# Altium schematic sheet Input Filter.SchDoc
size A4
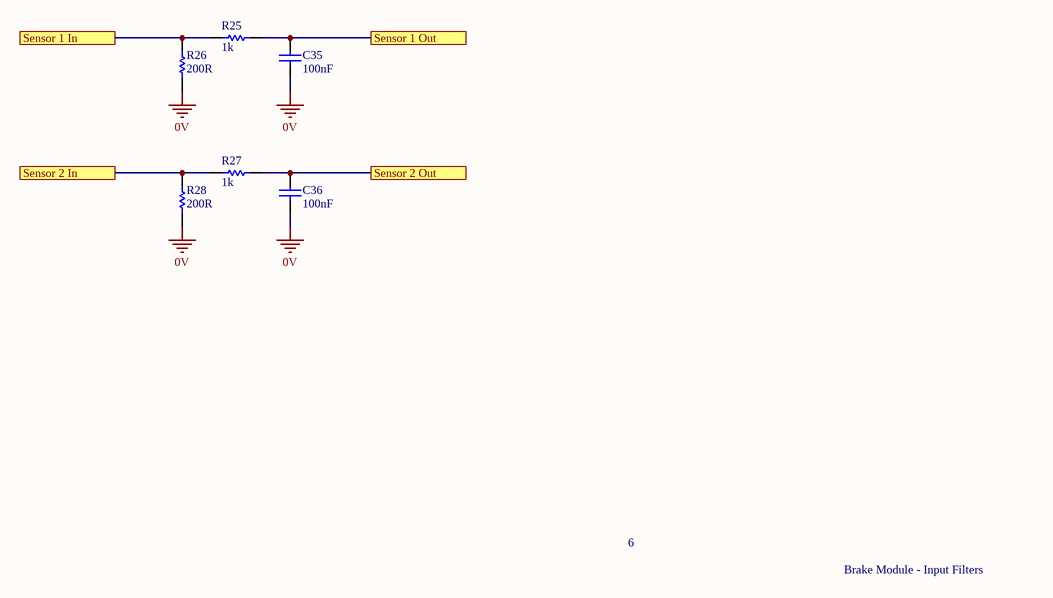
[diagram p0: Input Filter.SchDoc]

## Parts
C35  100nF  [0805]
C36  100nF  [0805]
R25  1k  [0805]
R26  200R  [0805]
R27  1k  [0805]
R28  200R  [0805]

## Ports
Sensor 1 In, Sensor 1 Out, Sensor 2 In, Sensor 2 Out

## Nets
0V: C35.1 C36.1 R26.1 R28.1
Sensor 1 In: R25.1 R26.2 ; port Sensor 1 In
Sensor 1 Out: C35.2 R25.2 ; port Sensor 1 Out
Sensor 2 In: R27.1 R28.2 ; port Sensor 2 In
Sensor 2 Out: C36.2 R27.2 ; port Sensor 2 Out

## Notes on the sheet
- 6
- Brake Module - Input Filters

## Library data of the parts
C35 C36 = GCM21BR71H104KA37L: Manufacturer: muRata; Tolerance: ±10%; Material: X7R; Rated Voltage: 50V; Part Number: GCM21BR71H104KA37L; Value: 100nF; Digikey Part Number: 490-6064-1-ND
R25 R27 = RC0805FR071KL: Manufacturer: YAGEO; Tolerance: 0.01; Rated Voltage: 0.125W; Part Number: RC0805FR071KL; Value: 1k; Material: FR-07; Digikey Part Number: 311-1.00KCRCT-ND
R26 R28 = RC0805FR07200RL: Manufacturer: YAGEO; Tolerance: 0.01; Rated Voltage: 0.125W; Part Number: RC0805FR07200RL; Value: 200R; Material: FR-07; Digikey Part Number: 311-200CRCT-ND